# EAGLE schematic serre (EAGLE 9.6.2)
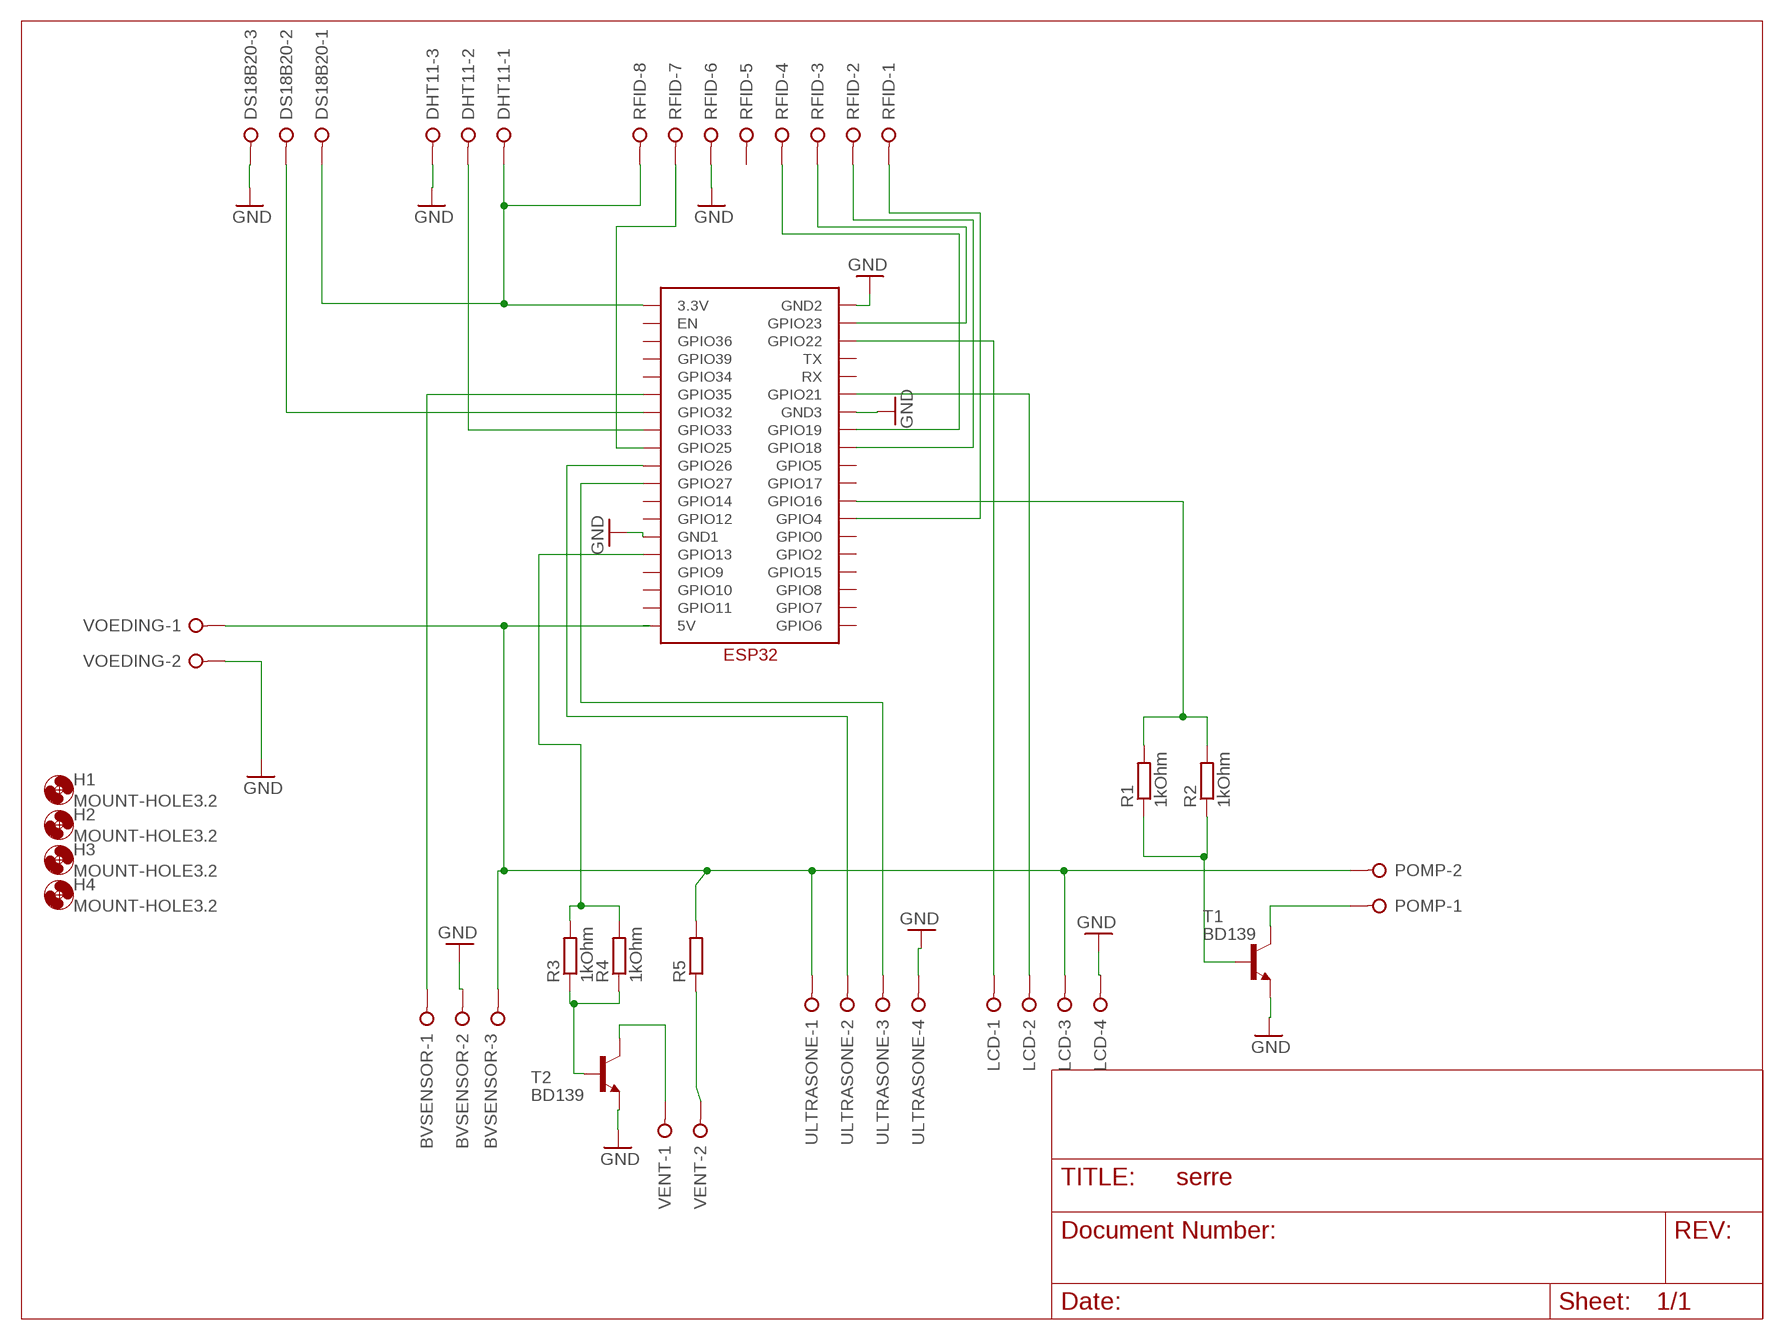
[diagram p0: schematic, sheet 1]

## Parts
BVSENSOR  W237-03P  [W237-133]
DHT11  W237-03P  [W237-133]
DS18B20  W237-03P  [W237-133]
H1  MOUNT-HOLE3.2  [3,2]
H2  MOUNT-HOLE3.2  [3,2]
H3  MOUNT-HOLE3.2  [3,2]
H4  MOUNT-HOLE3.2  [3,2]
LCD  W237-04P  [W237-4P]
POMP  W237-02P  [W237-132]
R1  1kOhm  R-EU_0207/10  [0207/10]
R2  1kOhm  R-EU_0207/10  [0207/10]
R3  1kOhm  R-EU_0207/10  [0207/10]
R4  1kOhm  R-EU_0207/10  [0207/10]
R5  R-EU_0207/10  [0207/10]
RFID  W237-08P  [W237-8P]
T1  BD139  [TO126]
T2  BD139  [TO126]
U$1  ESP32  [ESP32]
ULTRASONE  W237-04P  [W237-4P]
VENT  W237-02P  [W237-132]
VOEDING  W237-02P  [W237-132]

## Nets
GND: BVSENSOR.2 DHT11.3 DS18B20.3 LCD.4 RFID.6 T1.1(E) T2.1(E) U$1.GND1 U$1.GND2 U$1.GND3 ULTRASONE.4 VOEDING.2
N$1: LCD.2 U$1.GPIO21
N$2: DHT11.2 U$1.GPIO33
N$3: RFID.1 U$1.GPIO4
N$4: DS18B20.2 U$1.GPIO32
N$5: DHT11.1 DS18B20.1 RFID.8 U$1.3.3V
N$6: RFID.2 U$1.GPIO18
N$7: RFID.3 U$1.GPIO23
N$8: RFID.4 U$1.GPIO19
N$9: RFID.7 U$1.GPIO25
N$10: R1.2 R2.2 U$1.GPIO16
N$11: R1.1 R2.1 T1.3(B)
N$12: POMP.1 T1.2(C)
N$13: LCD.1 U$1.GPIO22
N$14: T2.2(C) VENT.1
N$15: BVSENSOR.1 U$1.GPIO35
N$16: U$1.GPIO27 ULTRASONE.3
N$17: U$1.GPIO26 ULTRASONE.2
N$18: R5.1 VENT.2
N$19: R3.1 R4.1 T2.3(B)
N$20: BVSENSOR.3 LCD.3 POMP.2 R5.2 U$1.5V ULTRASONE.1 VOEDING.1
N$21: R3.2 R4.2 U$1.GPIO13
Unconnected: RFID.5 U$1.EN U$1.GPIO0 U$1.GPIO2 U$1.GPIO5 U$1.GPIO6 U$1.GPIO7 U$1.GPIO8 U$1.GPIO9 U$1.GPIO10 U$1.GPIO11 U$1.GPIO12 U$1.GPIO14 U$1.GPIO15 U$1.GPIO17 U$1.GPIO34 U$1.GPIO36 U$1.GPIO39 U$1.RX U$1.TX

## Library data of the parts
BVSENSOR DHT11 DS18B20 = con-wago-508:W237-03P: WAGO SREW CLAMP; OC_FARNELL: unknown; OC_NEWARK: unknown
H1-H4 = holes:MOUNT-HOLE: MOUNTING HOLE with drill center marker
LCD ULTRASONE = con-wago-508:W237-04P: WAGO SREW CLAMP; OC_FARNELL: unknown; OC_NEWARK: unknown
POMP VENT VOEDING = con-wago-508:W237-02P: WAGO SREW CLAMP; OC_FARNELL: unknown; OC_NEWARK: unknown
R1-R5 = rcl:R-EU_: RESISTOR, European symbol; SPICEPREFIX: R
RFID = con-wago-508:W237-08P: WAGO SREW CLAMP; OC_FARNELL: unknown; OC_NEWARK: unknown
T1 T2 = transistor:BD139: NPN TRANSISTOR
U$1 = ESP32:ESP32